# Altium project CAN_MODULE_DRIVER_V_0.0.PrjPcb
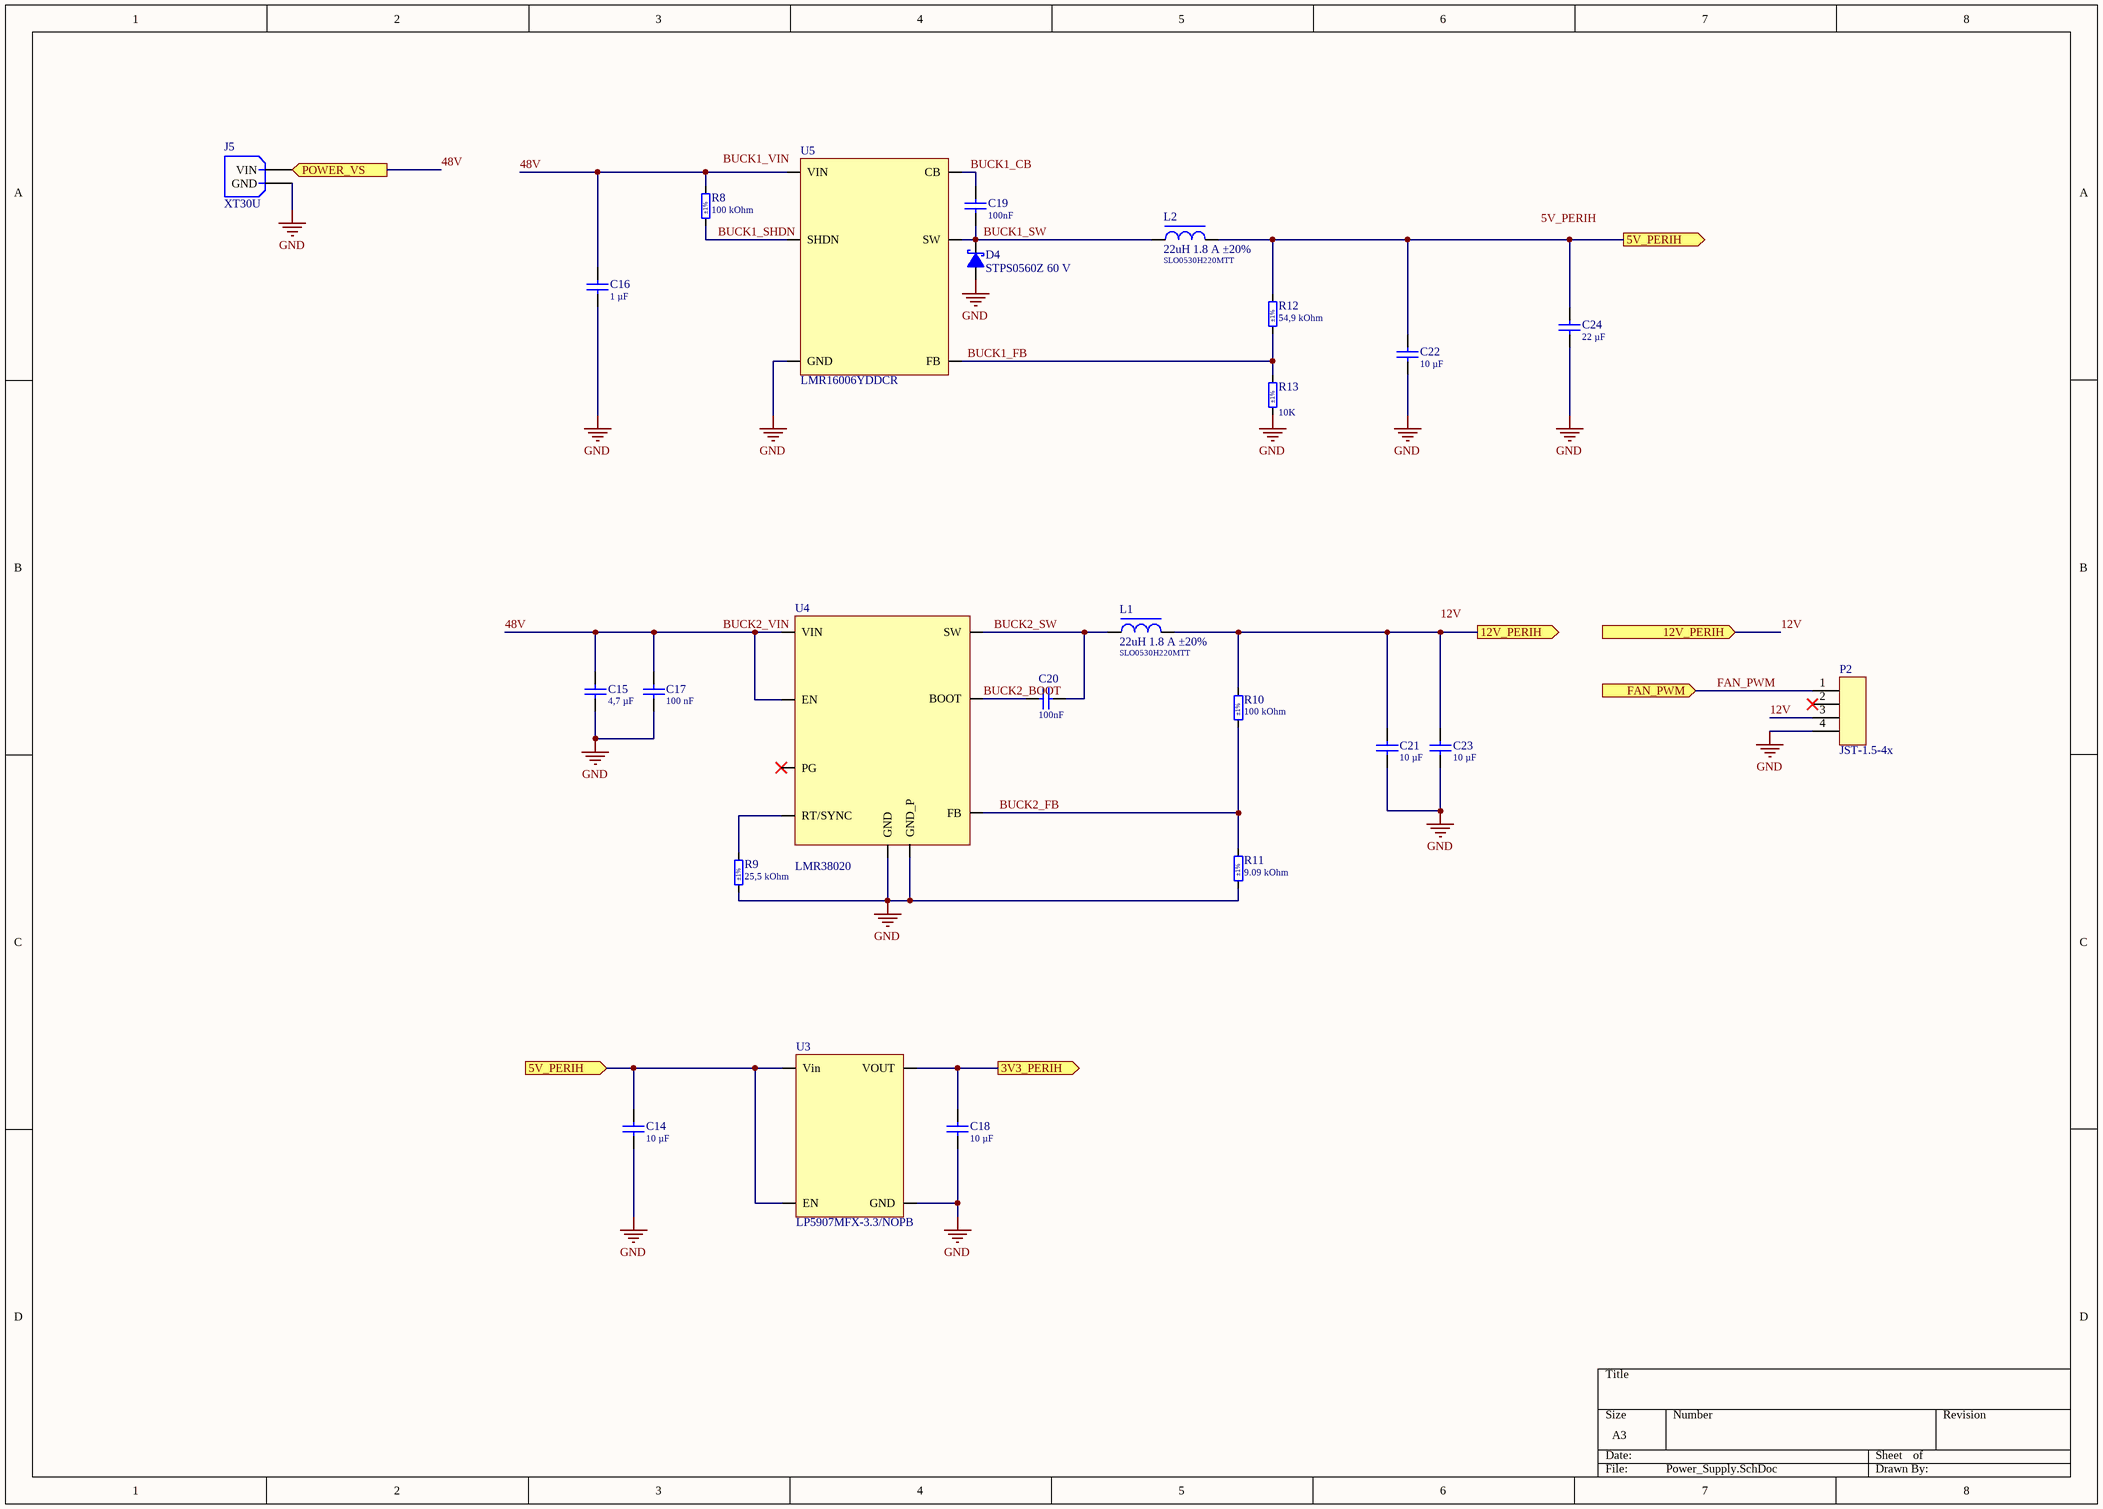
[diagram p0: Power_Supply.SchDoc]
3 sheets, 111 parts. Net scope: flat (ports and power ports of the same name join across sheets).
Board files: PCB3.PcbDoc, PCB4.PcbDoc
Sheets:
  Power_Supply.SchDoc
  Logic.~(138).SchDoc
  Driver.SchDoc

## Sheet Power_Supply.SchDoc
size A3

### Parts
C14  Capacitance: 10 µF  [0805]  (hidden comment: 10 µF 16V X5R ±10% 0805)
C15  Capacitance: 4,7 µF  [1206]  (hidden comment: 4,7 µF 100V X5R ±10% 1206)
C16  Capacitance: 1 µF  [0805]  (hidden comment: 1 µF 100V X5R ±10% 0805)
C17  Capacitance: 100 nF  [1206]  (hidden comment: 100 nF 100V X5R ±10% 1206)
C18  Capacitance: 10 µF  [0805]  (hidden comment: 10 µF 16V X5R ±10% 0805)
C19  Capacitance: 100nF  [0402]  (hidden comment: 100nF 16V X7R ±10% 0402)
C20  Capacitance: 100nF  [0402]  (hidden comment: 100nF 16V X7R ±10% 0402)
C21  Capacitance: 10 µF  [0805]  (hidden comment: 10 µF 16V X5R ±10% 0805)
C22  Capacitance: 10 µF  [0805]  (hidden comment: 10 µF 16V X5R ±10% 0805)
C23  Capacitance: 10 µF  [0805]  (hidden comment: 10 µF 16V X5R ±10% 0805)
C24  Capacitance: 22 µF  [0603]  (hidden comment: 22 µF 10V X5R ±10% 0603)
D4  STPS0560Z 60 V  [SOD-123FL]
J5  XT30U  [XT30U-M]
L1  22uH 1.8 A ±20%  Name: SLO0530H220MTT  [SMD 5.4x5.2mm]
L2  22uH 1.8 A ±20%  Name: SLO0530H220MTT  [SMD 5.4x5.2mm]
P2  JST-1.5-4x  [JST- 4X - 1.5]
R8  Resistance: 100 kOhm  [0402]  (hidden comment: 100 kOhm 1/8 W 0402)
R9  Resistance: 25,5 kOhm  [0402]  (hidden comment: 25,5 kOhm 1/16 W 0402)
R10  Resistance: 100 kOhm  [0402]  (hidden comment: 100 kOhm 1/8 W 0402)
R11  Resistance: 9.09 kOhm  [0402]  (hidden comment: 9.09 kOhm 1/16 W 0402)
R12  Resistance: 54,9 kOhm  [0402]  (hidden comment: 54,9 kOhm 1/16 W 0402)
R13  Resistance: 10K  [0402]  (hidden comment: 10K 1/5W 0402)
U3  LP5907MFX-3.3/NOPB  [SOT23-5]
U4  LMR38020  [SOIC-8_TP]
U5  LMR16006YDDCR  [SOT-23-6]

### Ports
3V3_PERIH (out), 5V_PERIH (in), 5V_PERIH (out), 12V_PERIH (in), 12V_PERIH (out), FAN_PWM (in), POWER_VS (out)

### Nets
3.3V: C18.1 U3.5(VOUT) ; port 3V3_PERIH
GND: C14.2 C15.2 C16.2 C17.2 C18.2 C21.2 C22.2 C23.2 C24.2 D4.2 J5.2(GND) P2.4 R9.1 R11.1 R13.1 U3.2(GND) U4.0(GND_P) U4.1(GND) U5.2(GND)
5V: C14.1 C22.1 C24.1 L2.2 R12.2 U3.1(Vin) U3.3(EN) ; port 5V_PERIH
12V: C21.1 C23.1 L1.2 P2.3 R10.2 ; port 12V_PERIH
48V: C15.1 C16.1 C17.1 J5.1(VIN) R8.2 U4.2(EN) U4.3(VIN) U5.5(VIN) ; port POWER_VS  [also labelled BUCK2_VIN]
BUCK1_CB: C19.2 U5.1(CB)
BUCK1_FB: R12.1 R13.2 U5.3(FB)
BUCK1_SHDN: R8.1 U5.4(SHDN)
BUCK1_SW: C19.1 D4.1 L2.1 U5.6(SW)
BUCK2_BOOT: C20.2 U4.7(BOOT)
BUCK2_FB: R10.1 R11.2 U4.5(FB)
BUCK2_SW: C20.1 L1.1 U4.8(SW)
FAN_PWM: P2.1 ; port FAN_PWM
NetR9_2: R9.2 U4.4(RT/SYNC)

Not connected (* = marked no-connect by the designer): P2 2*; U4 6(PG)*

### Notes on the sheet
- Labels drawn without touching a wire or pin: 5V_PERIH, 12V, BUCK1_VIN

### Library data of the parts
C14 C18 C21-C23 = Capacitor ceramic: Ceramic capacitor; Manufacturer: MURATA; HQ Part: CA0134789; Name: GRM21BR61C106KE15L; Voltage: 16V; Tolerance: ±10%; Dielectric: X5R; BOMString: =Capacitance+' '+Voltage+' '+Tolerance+' '+Footprint; HelpURL: *; Supplier: *
C15 = Capacitor ceramic: Ceramic capacitor; Manufacturer: Taiyo Yuden; Name: HMK325BJ475KN-TE; Voltage: 100V; Tolerance: ±10%; Dielectric: X5R; BOMString: =Capacitance+' '+Voltage+' '+Tolerance+' '+Footprint; HelpURL: *; Supplier: *
C16 = Capacitor ceramic: Ceramic capacitor; Manufacturer: Yageo; Name: CC0805KKX7R0BB105; Voltage: 100V; Tolerance: ±10%; Dielectric: X5R; BOMString: =Capacitance+' '+Voltage+' '+Tolerance+' '+Footprint; HelpURL: *; Supplier: *
C17 = Capacitor ceramic: Ceramic capacitor; Manufacturer: MURATA; Name: GRM155R62A104KE14D; Voltage: 100V; Tolerance: ±10%; Dielectric: X5R; BOMString: =Capacitance+' '+Voltage+' '+Tolerance+' '+Footprint; HelpURL: *; Supplier: *
C19 C20 = Capacitor ceramic: Ceramic capacitor; Manufacturer: Yageo; Name: CC0402KRX7R7BB104; Voltage: 16V; Tolerance: ±10%; Dielectric: X7R; BOMString: =Capacitance+' '+Voltage+' '+Tolerance+' '+Footprint; HelpURL: *; Supplier: *
C24 = Capacitor ceramic: Ceramic capacitor; Manufacturer: Yageo; Name: CC0603MRX5R6BB226; Voltage: 10V; Tolerance: ±10%; Dielectric: X5R; BOMString: =Capacitance+' '+Voltage+' '+Tolerance+' '+Footprint; HelpURL: *; Supplier: *
D4 = SchottkyDiode: Schottky Diode; Manufacturer: ST; HQ Part: DS0002882; Voltage: 60 V; Device: diode; Supplier: supplier; Price(1): 0; Price(100): 0; Name: STPS0560Z; BOMString: =Name+' '+Current+' '+Voltage+' 'Footprint
L1 L2 = Inductance cored: Inductor with iron core; Manufacturer: Sunltech; Current: 1.8 A; Resistance: 265mΩ; Inductance: 22uH; Tolerance: ±20%; BOMString: =Inductance+' '+Tolerance+' '+Footprint; HelpURL: *; Supplier: *
R8 = Resistor: Thik Film Chip Resistor; Manufacturer: Yageo; Power: 1/8 W; Tolerance: ±1%; Name: RC0402FR-7W100KL; Supplier: *; HelpURL: *; BOMString: =Resistance+' '+Tolerance+' '+Power+' '+Footprint
R9 = Resistor: Thik Film Chip Resistor; Manufacturer: Yageo; Power: 1/16 W; Tolerance: ±1%; Name: RC0402FR-0725K5L; Supplier: *; HelpURL: *; BOMString: =Resistance+' '+Tolerance+' '+Power+' '+Footprint
R10 = Resistor: Thik Film Chip Resistor; Manufacturer: Yageo; HQ Part: RE0186870; Power: 1/8 W; Tolerance: ±1%; Name: RC0402FR-7W100KL; Supplier: *; HelpURL: *; BOMString: =Resistance+' '+Tolerance+' '+Power+' '+Footprint
R11 = Resistor: Thik Film Chip Resistor; Manufacturer: Ralec; Power: 1/16 W; Tolerance: ±1%; Name: RTT029091FTH; Supplier: *; HelpURL: *; BOMString: =Resistance+' '+Tolerance+' '+Power+' '+Footprint
R12 = Resistor: Thik Film Chip Resistor; Manufacturer: Yageo; HQ Part: RE0186870; Power: 1/16 W; Tolerance: ±1%; Name: RC0402FR-0754K9L; Supplier: *; HelpURL: *; BOMString: =Resistance+' '+Tolerance+' '+Power+' '+Footprint
R13 = Resistor: Thin Film Chip Resistor; Manufacturer: YAGEO; Tolerance: ±1%; Name: SR0402FR-7T10KL; Power: 1/5W; Supplier: *; HelpURL: *; BOMString: =Resistance+' '+Tolerance+' '+Power+' '+Footprint
U3 = LP5907MFX-3.3/NOPB: "Low-dropout regulator"
U4 = LMR38020: Name: LMR38020; Manufacturer: *; BOMString: *; Value: *; Parameter 5: *; Parameter 6: *

## Sheet Logic.~(138).SchDoc
size A3
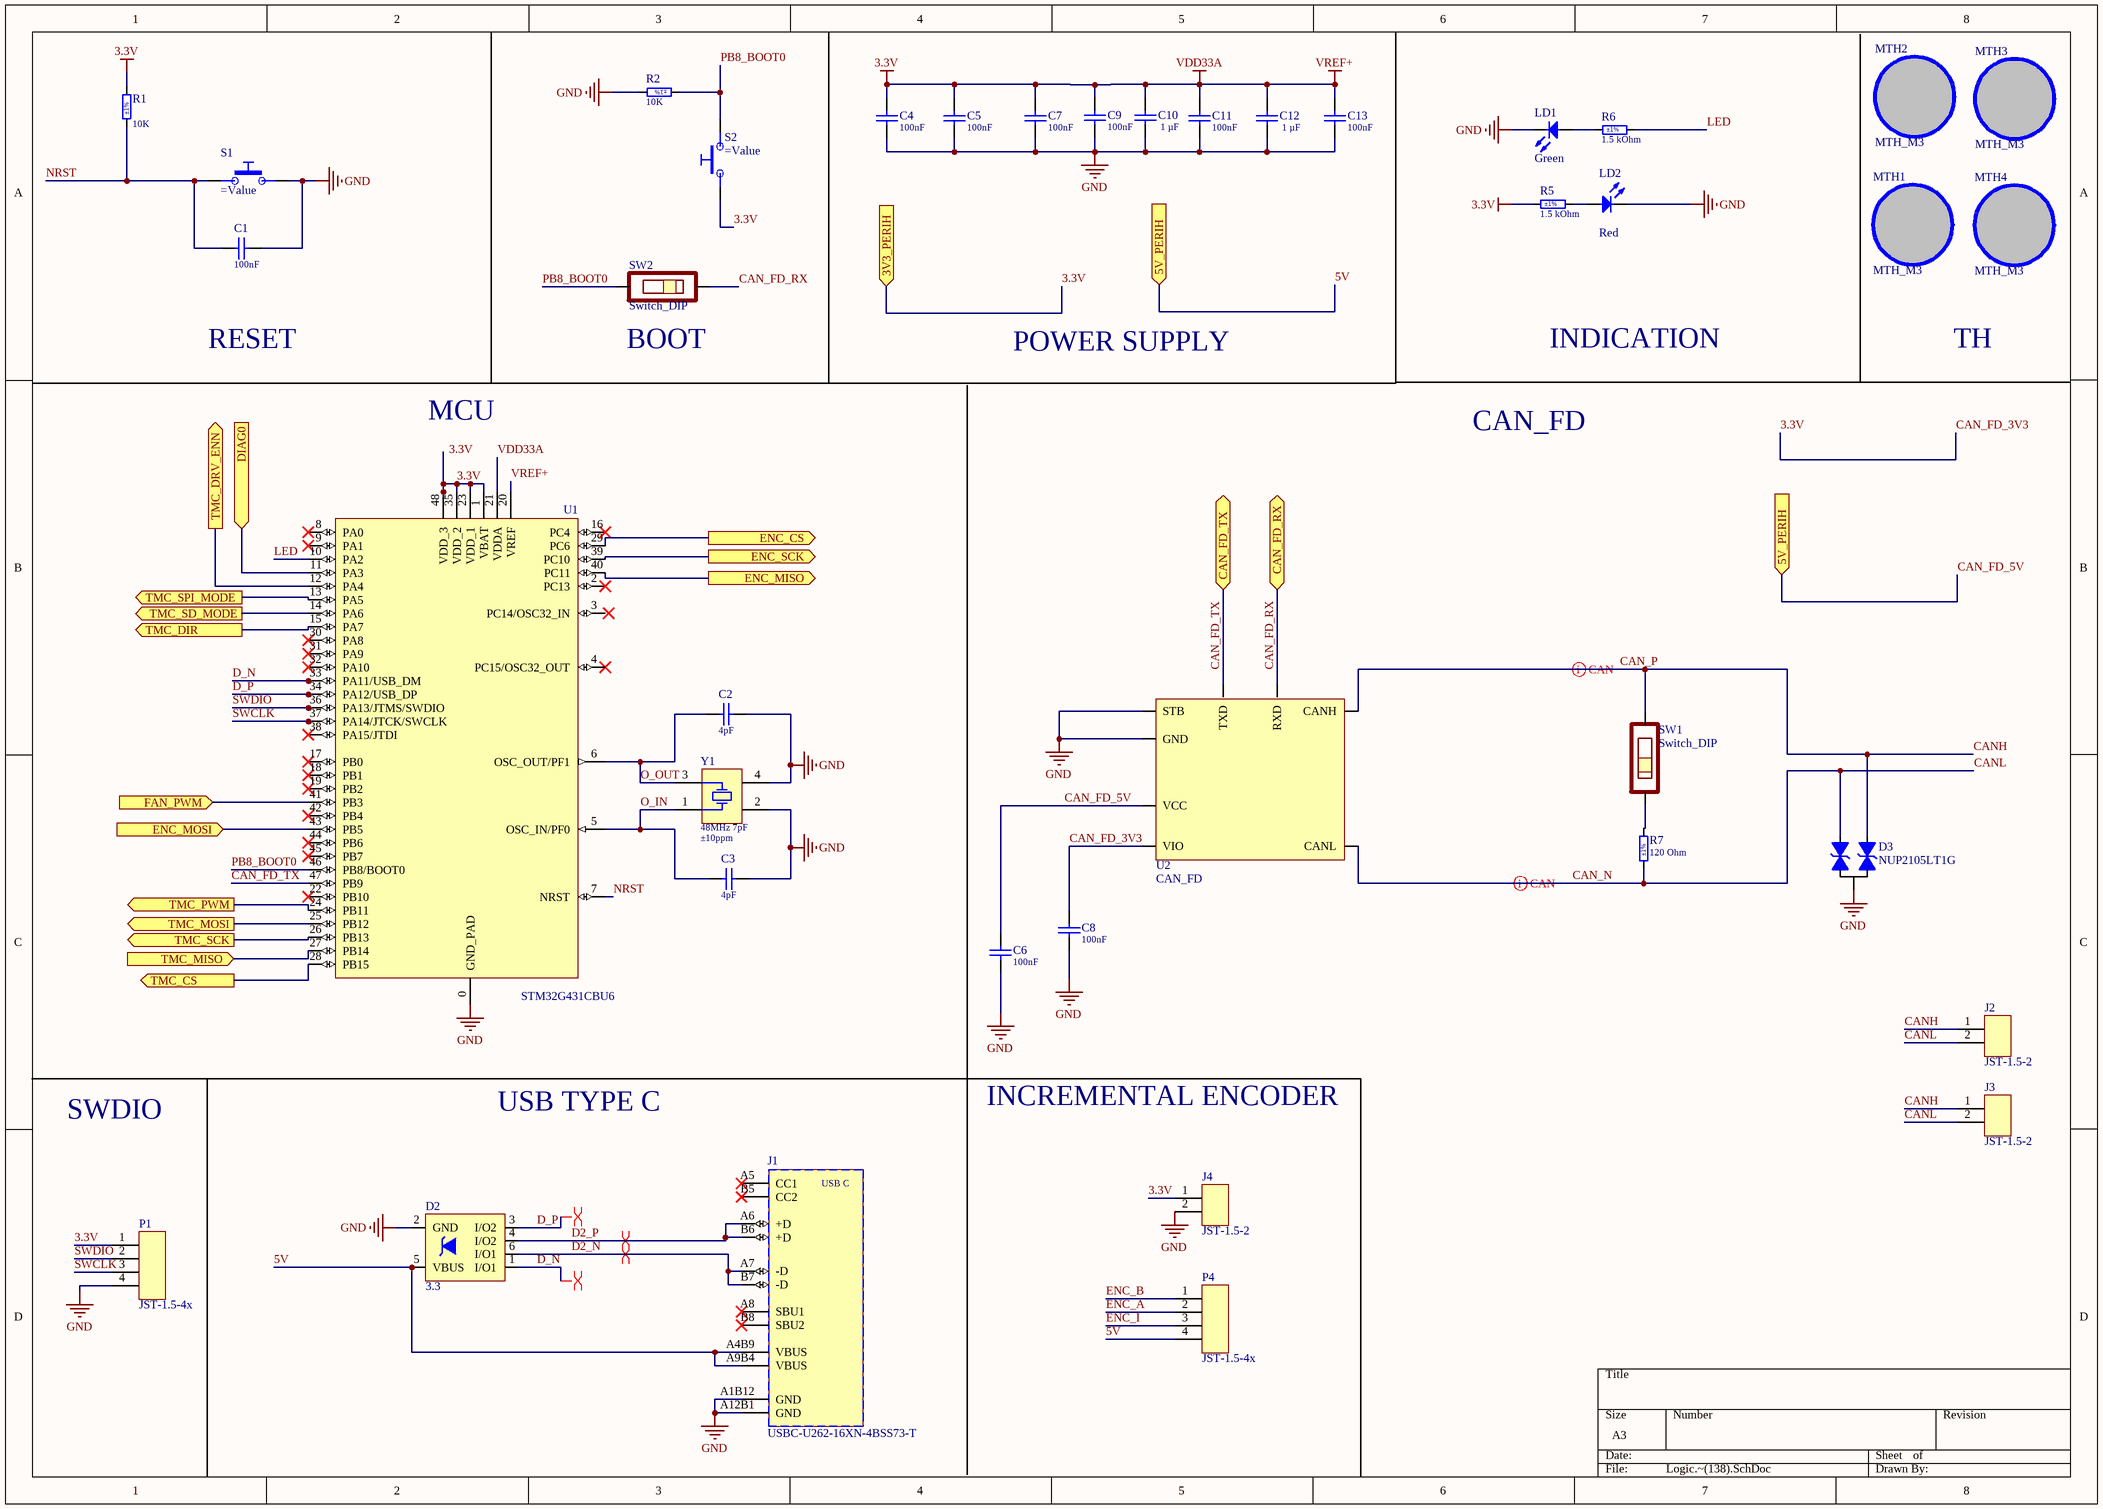
[diagram p1: Logic.~(138).SchDoc]

### Parts
C1  Capacitance: 100nF  [0402]  (hidden comment: 100nF 16V X7R ±10% 0402)
C2  Capacitance: 4pF  [0402]  (hidden comment: 4pF 50V C0G (NP0) ±0.25 pF 0402)
C3  Capacitance: 4pF  [0402]  (hidden comment: 4pF 50V C0G (NP0) ±0.25 pF 0402)
C4  Capacitance: 100nF  [0402]  (hidden comment: 100nF 16V X7R ±10% 0402)
C5  Capacitance: 100nF  [0402]  (hidden comment: 100nF 16V X7R ±10% 0402)
C6  Capacitance: 100nF  [0402]  (hidden comment: 100nF 16V X7R ±10% 0402)
C7  Capacitance: 100nF  [0402]  (hidden comment: 100nF 16V X7R ±10% 0402)
C8  Capacitance: 100nF  [0402]  (hidden comment: 100nF 16V X7R ±10% 0402)
C9  Capacitance: 100nF  [0402]  (hidden comment: 100nF 16V X7R ±10% 0402)
C10  Capacitance: 1 µF  [0402]  (hidden comment: 1 µF 16V X5R ±10% 0402)
C11  Capacitance: 100nF  [0402]  (hidden comment: 100nF 16V X7R ±10% 0402)
C12  Capacitance: 1 µF  [0402]  (hidden comment: 1 µF 16V X5R ±10% 0402)
C13  Capacitance: 100nF  [0402]  (hidden comment: 100nF 16V X7R ±10% 0402)
D2  3.3  [SOT23-6L]
D3  Name: NUP2105LT1G  [SOT-23]  (hidden comment: VRWM=24V, VBR(Min)=26.2 V, VC=44 V)
J1  USBC-U262-16XN-4BSS73-T  [KH-TYPE-C-16P-T]
J2  JST-1.5-2  [JST- 2 X - 1.5]
J3  JST-1.5-2  [JST- 2 X - 1.5]
J4  JST-1.5-2  [JST- 2 X - 1.5]
LD1  Color: Green  [0402 GREEN FLAT]  (hidden comment: SZYY0402G (Green) / 0402 GREEN FLAT)
LD2  Color: Red  [0402 RED FLAT]  (hidden comment: SML-P11UTT86R (Red) / 0402 RED FLAT)
MTH1  MTH_M3  [MTH]
MTH2  MTH_M3  [MTH]
MTH3  MTH_M3  [MTH]
MTH4  MTH_M3  [MTH]
P1  JST-1.5-4x  [JST- 4X - 1.5]
P4  JST-1.5-4x  [JST- 4X - 1.5]
R1  Resistance: 10K  [0402]  (hidden comment: 10K 1/5W 0402)
R2  Resistance: 10K  [0402]  (hidden comment: 10K 1/5W 0402)
R5  Resistance: 1.5 kOhm  [0402]  (hidden comment: 1.5 kOhm 1/16W 0402)
R6  Resistance: 1.5 kOhm  [0402]  (hidden comment: 1.5 kOhm 1/16W 0402)
R7  Resistance: 120 Ohm  [0402]  (hidden comment: 120 Ohm 1/8 W 0402)
S1  (no value)  [B3U3000P]
S2  (no value)  [B3U3000P]
SW1  Switch_DIP  [SMD 2.9x5.4mm]
SW2  Switch_DIP  [SMD 2.9x5.4mm]
U1  STM32G431CBU6  [QFN-48-0.5-7x7_TP]
U2  CAN_FD  [SOIC-8]
Y1  Frequency: 48MHz 7pF  Tolerance: ±10ppm  [2016]  (hidden comment: 48MHz 7pF ±10ppm 2016)

### Ports
3V3_PERIH (in), 5V_PERIH (in), CAN_FD_RX (bidir), CAN_FD_TX (bidir), DIAG0 (in), ENC_CS (out), ENC_MISO (out), ENC_MOSI (in), ENC_SCK (out), FAN_PWM (in), TMC_CS (out), TMC_DIR (out), TMC_DRV_ENN (out), TMC_MISO (in), TMC_MOSI (out), TMC_PWM (out), TMC_SCK (out), TMC_SD_MODE (out), TMC_SPI_MODE (out)

### Nets
3.3V: C4.2 C5.2 C7.2 C8.2 C9.2 C10.1 C11.2 C12.1 C13.2 J4.1 P1.1 R1.2 R5.1 S2.1 U1.1(VBAT) U1.20(VREF) U1.21(VDDA) U1.23(VDD_1) U1.35(VDD_2) U1.48(VDD_3) U2.5(VIO) ; port 3V3_PERIH  [also labelled CAN_FD_3V3, VDD33A, VREF+]
GND: C1.1 C2.2 C3.2 C4.1 C5.1 C6.1 C7.1 C8.1 C9.1 C10.2 C11.1 C12.2 C13.1 D2.2(GND) D3.3 J1.A1B12(GND) J1.A12B1(GND) J4.2 LD1.2(C) LD2.2(C) P1.4 R2.2 S1.2 U1.0(GND_PAD) U2.2(GND) U2.8(STB) Y1.2(GND) Y1.4(GND)
5V: C6.2 D2.5(VBUS) J1.A4B9(VBUS) J1.A9B4(VBUS) P4.4 U2.3(VCC) ; port 5V_PERIH  [also labelled CAN_FD_5V]
CAN_FD_RX: SW2.2 U2.4(RXD) ; port CAN_FD_RX
CAN_FD_TX: U1.47(PB9) U2.1(TXD) ; port CAN_FD_TX
CAN_N: D3.2 J2.2 J3.2 R7.1 U2.6(CANL)  [also labelled CANL]
CAN_P: D3.1 J2.1 J3.1 SW1.1 U2.7(CANH)  [also labelled CANH]
D2_N: D2.6(I/O1) J1.A7(-D) J1.B7(-D)
D2_P: D2.4(I/O2) J1.A6(+D) J1.B6(+D)
D_N: D2.1(I/O1) U1.33(PA11/USB_DM)
D_P: D2.3(I/O2) U1.34(PA12/USB_DP)
DIAG0: U1.11(PA3) ; port DIAG0
ENC_A: P4.2
ENC_B: P4.1
ENC_CS: U1.29(PC6) ; port ENC_CS
ENC_I: P4.3
ENC_MISO: U1.40(PC11) ; port ENC_MISO
ENC_MOSI: U1.43(PB5) ; port ENC_MOSI
ENC_SCK: U1.39(PC10) ; port ENC_SCK
FAN_PWM: U1.41(PB3) ; port FAN_PWM
LED: R6.2 U1.10(PA2)
NRST: C1.2 R1.1 S1.1 U1.7(NRST)
O_IN: C3.1 U1.5(OSC_IN/PF0) Y1.1(X)
O_OUT: C2.1 U1.6(OSC_OUT/PF1) Y1.3(X)
PB8_BOOT0: R2.1 S2.2 SW2.1 U1.46(PB8/BOOT0)
SD_MODE: U1.14(PA6) ; port TMC_SD_MODE
SPI_MODE: U1.13(PA5) ; port TMC_SPI_MODE
SWCLK: P1.3 U1.37(PA14/JTCK/SWCLK)
SWDIO: P1.2 U1.36(PA13/JTMS/SWDIO)
TMC_CS: U1.28(PB15) ; port TMC_CS
TMC_DIR: U1.15(PA7) ; port TMC_DIR
TMC_DRV_ENN: U1.12(PA4) ; port TMC_DRV_ENN
TMC_MISO: U1.27(PB14) ; port TMC_MISO
TMC_MOS: U1.25(PB12) ; port TMC_MOSI
TMC_PWM: U1.24(PB11) ; port TMC_PWM
TMC_SCK: U1.26(PB13) ; port TMC_SCK
NetLD1_1: LD1.1(A) R6.1
NetLD2_1: LD2.1(A) R5.2
NetR7_2: R7.2 SW1.2

Not connected (* = marked no-connect by the designer): J1 A5(CC1)* A8(SBU1)* B5(CC2)* B8(SBU2)*; U1 2(PC13)* 3(PC14/OSC32_IN) 4(PC15/OSC32_OUT)* 8(PA0)* 9(PA1)* 16(PC4)* 17(PB0)* 18(PB1)* 19(PB2)* 22(PB10)* 30(PA8)* 31(PA9)* 32(PA10)* 38(PA15/JTDI)* 42(PB4)* 44(PB6)* 45(PB7)*

### Layout directives
differential pair: CAN_N, CAN_P, D2_N, D2_P, D_N, D_P

### Notes on the sheet
- RESET
- (near SW2) BOOT
- POWER SUPPLY
- INDICATION
- TH
- MCU
- CAN_FD
- SWDIO
- USB TYPE C
- INCREMENTAL ENCODER
- Labels drawn without touching a wire or pin: 3.3V
- (in symbol USBC-U262-16XN-4BSS73-T) USB C

### Library data of the parts
C1 C4-C9 C11 C13 = Capacitor ceramic: as C19 on sheet Power_Supply; Voltage: 16V; Tolerance: ±10%; Dielectric: X7R; BOMString: =Capacitance+' '+Voltage+' '+Tolerance+' '+Footprint; HelpURL: *; Supplier: *
C2 C3 = Capacitor ceramic: Ceramic capacitor; Manufacturer: Murata; Tolerance: ±0.25 pF; Name: CC0402CRNPO9BN4R0; Voltage: 50V; Dielectric: C0G (NP0); BOMString: =Capacitance+' '+Voltage+' '+Tolerance+' '+Footprint; HelpURL: *; Supplier: *
C10 C12 = Capacitor ceramic: Ceramic capacitor; Manufacturer: Yageo; Name: CC0402KRX5R7BB105; Voltage: 16V; Tolerance: ±10%; Dielectric: X5R; BOMString: =Capacitance+' '+Voltage+' '+Tolerance+' '+Footprint; HelpURL: *; Supplier: *
D2 = TWS_USB_sot23: TWS; Manufacturer: ST; BOMString: USBLC6-2SC6 3.3; Name: USBLC6-2SC6; Price: 0; Price10k: 0; Value: 3.3
D3 = ZenerDiodeDoubleCCBidir: Zener Diode double CC; Manufacturer: ON; HQ Part: CP0103362; BOMString: ESD VRWM=24V, VBR(Min)=26.2 V, VC=44 V, IPP = 8A, Ppp = 350W, SOT23; Device: diode; Supplier: supplier; Price(1): 0; Price(100): 0; Value: VRWM=24V, VBR(Min)=26.2 V, VC=44 V
LD1 = LED Green: Green LED; Manufacturer: YONGYU; Current: 15 mA; Name: SZYY0402G; BOMString: =Name+' ('+Color+ ') / '+' '+Current+' '+Footprint; Supplier: *; HelpURL: *
LD2 = LED Red: Red LED; Manufacturer: ROHM; Current: 20 mA; Name: SML-P11UTT86R; BOMString: =Name+' ('+Color+ ') / '+' '+Current+' '+Footprint; HelpURL: *; Supplier: *; Parameter 1: *
R1 R2 = Resistor: as R13 on sheet Power_Supply; Power: 1/5W; Supplier: *; HelpURL: *; BOMString: =Resistance+' '+Tolerance+' '+Power+' '+Footprint
R5 R6 = Resistor: Thin Film Chip Resistor; Manufacturer: YAGEO; Tolerance: ±1%; Name: AC0402FR-071K5L; Power: 1/16W; Supplier: *; HelpURL: *; BOMString: =Resistance+' '+Tolerance+' '+Power+' '+Footprint
R7 = Resistor: Thick Film Chip Resistor; Manufacturer: Yageo; HQ Part: RE0210070; Power: 1/8 W; Tolerance: ±1%; Name: RC0402FR-7W120RL; Supplier: *; HelpURL: *; BOMString: =Resistance+' '+Tolerance+' '+Power+' '+Footprint; Supplier 1: Future Electronics
S1 S2 = TactileButton2pin: SMD Tactile switch; Value: B3U3000P; Supplier: http://www.compel.ru/infosheet/TE/1437566-3; Price(1): 0.218; Price(100): 0.1817; Datasheet: http://www.te.com/usa-en/product-1437566-3.html; BOMString: =Footprint; Name: =Footprint
Y1 = Crystal 4 pin: Quartz crystal; Manufacturer: HD FREQUENCY; Name: 7D048000C01; HelpURL: http://geyer-electronic.de/uploads/tx_userartikelfrequenz/GEYER-KX-9A_01.pdf; Supplier: *; BOMString: =Frequency+' '+Tolerance+' '+Footprint

## Sheet Driver.SchDoc
size A3
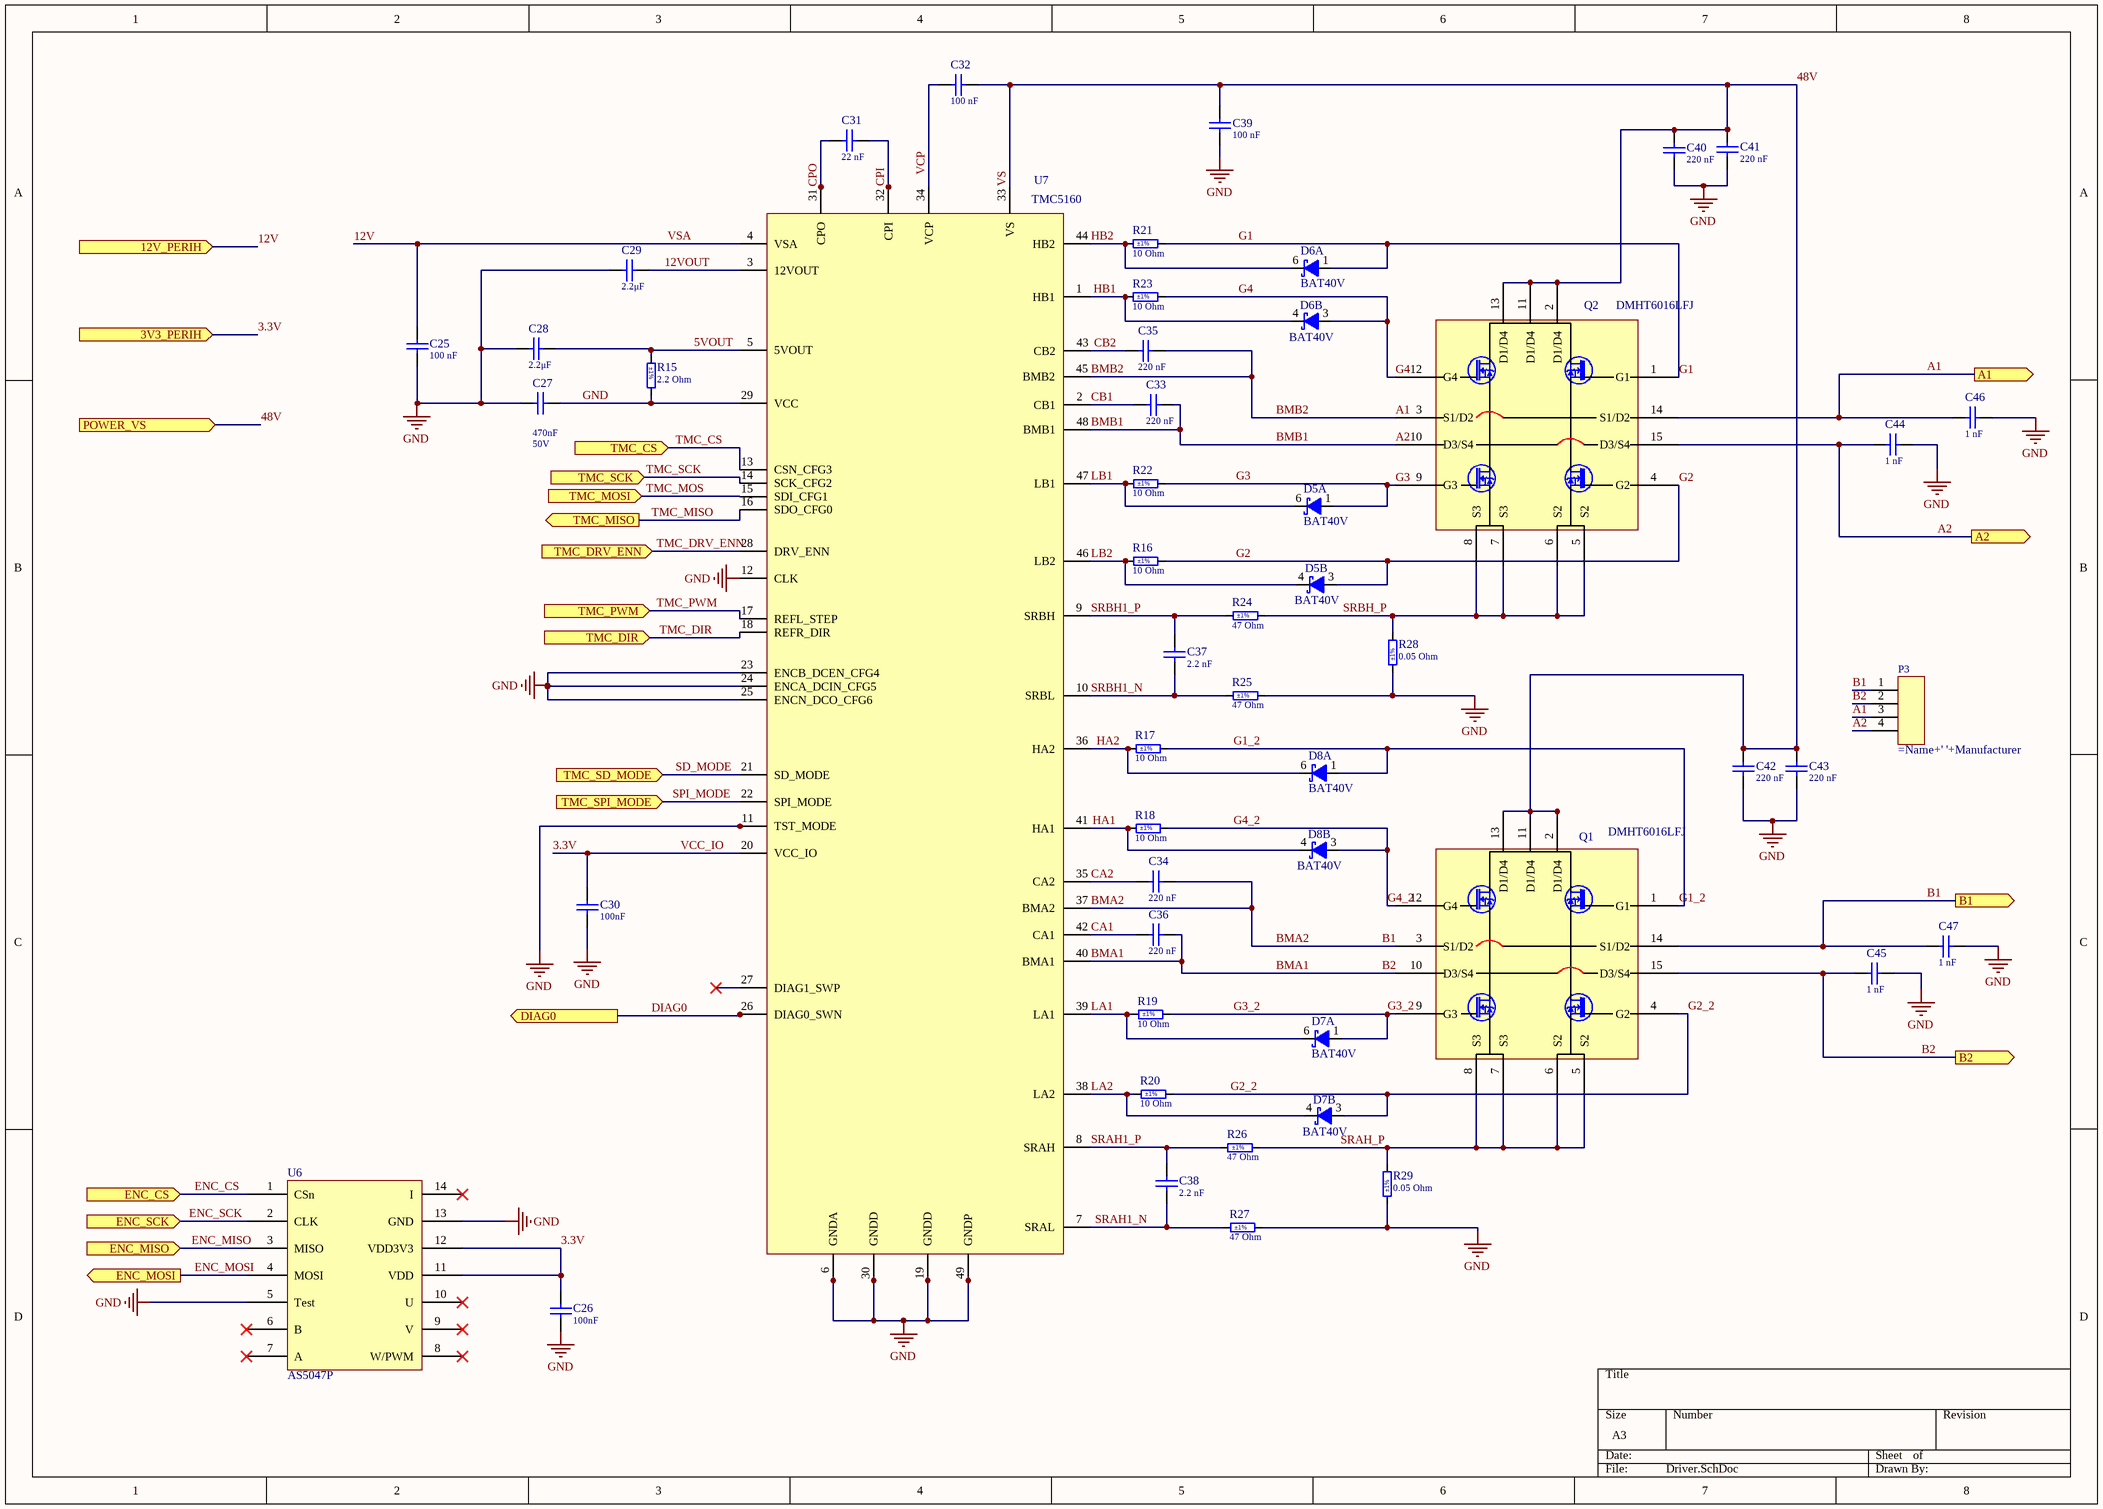
[diagram p2: Driver.SchDoc]

### Parts
C25  Capacitance: 100 nF  [0402]  (hidden comment: 100 nF 100V X5R ±10% 0402)
C26  Capacitance: 100nF  [0402]  (hidden comment: 100nF 16V X7R ±10% 0402)
C27  Capacitance: 470nF  Voltage: 50V  [0402]  (hidden comment: 470nF 50V ±10% 0402)
C28  Capacitance: 2.2μF  [0402]  (hidden comment: 2.2μF 16V X5R 20% 0402)
C29  Capacitance: 2.2μF  [0402]  (hidden comment: 2.2μF 16V X5R 20% 0402)
C30  Capacitance: 100nF  [0402]  (hidden comment: 100nF 16V X7R ±10% 0402)
C31  Capacitance: 22 nF  [0603]  (hidden comment: 22 nF 100V X7R ±10% 0603)
C32  Capacitance: 100 nF  [0402]  (hidden comment: 100 nF 100V X5R ±10% 0402)
C33  Capacitance: 220 nF  [0402]  (hidden comment: 220 nF 25 X7R ±10% 0402)
C34  Capacitance: 220 nF  [0402]  (hidden comment: 220 nF 25 X7R ±10% 0402)
C35  Capacitance: 220 nF  [0603]  (hidden comment: 220 nF 25 X7R ±10% 0603)
C36  Capacitance: 220 nF  [0603]  (hidden comment: 220 nF 25 X7R ±10% 0603)
C37  Capacitance: 2.2 nF  [0402]  (hidden comment: 2.2 nF 100V X7R ±10% 0402)
C38  Capacitance: 2.2 nF  [0402]  (hidden comment: 2.2 nF 100V X7R ±10% 0402)
C39  Capacitance: 100 nF  [0402]  (hidden comment: 100 nF 100V X5R ±10% 0402)
C40  Capacitance: 220 nF  [0603]  (hidden comment: 220 nF 100V X7S ±10% 0603)
C41  Capacitance: 220 nF  [0603]  (hidden comment: 220 nF 100V X7S ±10% 0603)
C42  Capacitance: 220 nF  [0603]  (hidden comment: 220 nF 100V X7S ±10% 0603)
C43  Capacitance: 220 nF  [0603]  (hidden comment: 220 nF 100V X7S ±10% 0603)
C44  Capacitance: 1 nF  [0402]  (hidden comment: 1 nF 100V X7R ±10% 0402)
C45  Capacitance: 1 nF  [0402]  (hidden comment: 1 nF 100V X7R ±10% 0402)
C46  Capacitance: 1 nF  [0402]  (hidden comment: 1 nF 100V X7R ±10% 0402)
C47  Capacitance: 1 nF  [0402]  (hidden comment: 1 nF 100V X7R ±10% 0402)
D5  BAT40V  [SOT563-6]  (parts A,B of 2)
D6  BAT40V  [SOT563-6]  (parts A,B of 2)
D7  BAT40V  [SOT563-6]  (parts A,B of 2)
D8  BAT40V  [SOT563-6]  (parts A,B of 2)
P3  (no value)  [15EDGRC-3.5-04P]
Q1  DMHT6016LFJ  [V-DFN5045-12 (Type B)]
Q2  DMHT6016LFJ  [V-DFN5045-12 (Type B)]
R15  Resistance: 2.2 Ohm  [0603]  (hidden comment: 2.2 Ohm 1/10 W 0603)
R16  Resistance: 10 Ohm  [0402]  (hidden comment: 10 Ohm 1/16 W 0402)
R17  Resistance: 10 Ohm  [0402]  (hidden comment: 10 Ohm 1/16 W 0402)
R18  Resistance: 10 Ohm  [0402]  (hidden comment: 10 Ohm 1/16 W 0402)
R19  Resistance: 10 Ohm  [0402]  (hidden comment: 10 Ohm 1/16 W 0402)
R20  Resistance: 10 Ohm  [0402]  (hidden comment: 10 Ohm 1/16 W 0402)
R21  Resistance: 10 Ohm  [0402]  (hidden comment: 10 Ohm 1/16 W 0402)
R22  Resistance: 10 Ohm  [0402]  (hidden comment: 10 Ohm 1/16 W 0402)
R23  Resistance: 10 Ohm  [0402]  (hidden comment: 10 Ohm 1/16 W 0402)
R24  Resistance: 47 Ohm  [0402]  (hidden comment: 47 Ohm 1/16 W 0402)
R25  Resistance: 47 Ohm  [0402]  (hidden comment: 47 Ohm 1/16 W 0402)
R26  Resistance: 47 Ohm  [0402]  (hidden comment: 47 Ohm 1/16 W 0402)
R27  Resistance: 47 Ohm  [0402]  (hidden comment: 47 Ohm 1/16 W 0402)
R28  Resistance: 0.05 Ohm  [1206]  (hidden comment: 0.05 Ohm 1 W 1206)
R29  Resistance: 0.05 Ohm  [1206]  (hidden comment: 0.05 Ohm 1 W 1206)
U6  AS5047P  [TSSOP-14-0.65]
U7  TMC5160  [TQFP48-0.5-EP]

### Ports
3V3_PERIH (in), 12V_PERIH (in), A1 (out), A2 (out), B1 (out), B2 (out), DIAG0 (out), ENC_CS (in), ENC_MISO (in), ENC_MOSI (out), ENC_SCK (in), POWER_VS (in), TMC_CS (in), TMC_DIR (in), TMC_DRV_ENN (in), TMC_MISO (out), TMC_MOSI (in), TMC_PWM (in), TMC_SCK (in), TMC_SD_MODE (in), TMC_SPI_MODE (in)

### Nets
3.3V: C26.2 C30.2 U6.11(VDD) U6.12(VDD3V3) U7.20(VCC_IO) ; port 3V3_PERIH  [also labelled VCC_IO]
GND: C25.2 C26.1 C27.1 C27.2 C28.1 C29.1 C30.1 C39.2 C40.2 C41.1 C42.1 C43.1 C44.1 C45.1 C46.1 C47.1 R15.2 R25.2 R27.2 R28.1 R29.1 U6.5(Test) U6.13(GND) U7.6(GNDA) U7.11(TST_MODE) U7.12(CLK) U7.19(GNDD) U7.23(ENCB_DCEN_CFG4) U7.24(ENCA_DCIN_CFG5) U7.25(ENCN_DCO_CFG6) U7.29(VCC) U7.30(GNDD) U7.49(GNDP)
5VOUT: C28.2 R15.1 U7.5(5VOUT)
12V: C25.1 U7.4(VSA) ; port 12V_PERIH  [also labelled VSA]
12VOUT: C29.2 U7.3(12VOUT)
48V: C32.2 C39.1 C40.1 C41.2 C42.2 C43.2 Q1.2(D1/D4) Q1.11(D1/D4) Q1.13(D1/D4) Q2.2(D1/D4) Q2.11(D1/D4) Q2.13(D1/D4) U7.33(VS) ; port POWER_VS  [also labelled VS]
A1: C35.2 C46.2 P3.3 Q2.3(S1/D2) Q2.14(S1/D2) U7.45(BMB2) ; port A1  [also labelled BMB2]
A2: C33.2 C44.2 P3.4 Q2.10(D3/S4) Q2.15(D3/S4) U7.48(BMB1) ; port A2  [also labelled BMB1]
B1: C34.2 C47.2 P3.1 Q1.3(S1/D2) Q1.14(S1/D2) U7.37(BMA2) ; port B1  [also labelled BMA2]
B2: C36.2 C45.2 P3.2 Q1.10(D3/S4) Q1.15(D3/S4) U7.40(BMA1) ; port B2  [also labelled BMA1]
CA1: C36.1 U7.42(CA1)
CA2: C34.1 U7.35(CA2)
CB1: C33.1 U7.2(CB1)
CB2: C35.1 U7.43(CB2)
CPI: C31.2 U7.32(CPI)
CPO: C31.1 U7.31(CPO)
DIAG0: U7.26(DIAG0_SWN) ; port DIAG0
ENC_CS: U6.1(CSn) ; port ENC_CS
ENC_MISO: U6.3(MISO) ; port ENC_MISO
ENC_MOSI: U6.4(MOSI) ; port ENC_MOSI
ENC_SCK: U6.2(CLK) ; port ENC_SCK
G1: D6.1 Q2.1(G1) R21.2
G1_2: D8.1 Q1.1(G1) R17.2
G2: D5.3 Q2.4(G2) R16.2
G2_2: D7.3 Q1.4(G2) R20.2
G3: D5.1 Q2.9(G3) R22.2
G3_2: D7.1 Q1.9(G3) R19.2
G4: D6.3 Q2.12(G4) R23.2
G4_2: D8.3 Q1.12(G4) R18.2
HA1: D8.4 R18.1 U7.41(HA1)
HA2: D8.6 R17.1 U7.36(HA2)
HB1: D6.4 R23.1 U7.1(HB1)
HB2: D6.6 R21.1 U7.44(HB2)
LA1: D7.6 R19.1 U7.39(LA1)
LA2: D7.4 R20.1 U7.38(LA2)
LB1: D5.6 R22.1 U7.47(LB1)
LB2: D5.4 R16.1 U7.46(LB2)
SD_MODE: U7.21(SD_MODE) ; port TMC_SD_MODE
SPI_MODE: U7.22(SPI_MODE) ; port TMC_SPI_MODE
SRAH1_N: C38.1 R27.1 U7.7(SRAL)
SRAH1_P: C38.2 R26.1 U7.8(SRAH)
SRAH_P: Q1.5(S2) Q1.6(S2) Q1.7(S3) Q1.8(S3) R26.2 R29.2
SRBH1_N: C37.1 R25.1 U7.10(SRBL)
SRBH1_P: C37.2 R24.1 U7.9(SRBH)
SRBH_P: Q2.5(S2) Q2.6(S2) Q2.7(S3) Q2.8(S3) R24.2 R28.2
TMC_CS: U7.13(CSN_CFG3) ; port TMC_CS
TMC_DIR: U7.18(REFR_DIR) ; port TMC_DIR
TMC_DRV_ENN: U7.28(DRV_ENN) ; port TMC_DRV_ENN
TMC_MISO: U7.16(SDO_CFG0) ; port TMC_MISO
TMC_MOS: U7.15(SDI_CFG1) ; port TMC_MOSI
TMC_PWM: U7.17(REFL_STEP) ; port TMC_PWM
TMC_SCK: U7.14(SCK_CFG2) ; port TMC_SCK
VCP: C32.1 U7.34(VCP)

Not connected (* = marked no-connect by the designer): U6 6(B)* 7(A)* 8(W/PWM)* 9(V)* 10(U)* 14(I)*; U7 27(DIAG1_SWP)*

### Library data of the parts
C25 C32 C39 = Capacitor ceramic: as C17 on sheet Power_Supply; Voltage: 100V; Tolerance: ±10%; Dielectric: X5R; BOMString: =Capacitance+' '+Voltage+' '+Tolerance+' '+Footprint; HelpURL: *; Supplier: *
C26 C30 = Capacitor ceramic: as C19 on sheet Power_Supply; Voltage: 16V; Tolerance: ±10%; Dielectric: X7R; BOMString: =Capacitance+' '+Voltage+' '+Tolerance+' '+Footprint; HelpURL: *; Supplier: *
C27 = Cap: Capacitor; Manufacturer: Walsin; Name: 0402X474K500CT; Tolerance: ±10%; BOMString: =Capacitance+' '+Voltage+' '+Tolerance+' '+Footprint; HelpURL: *; Supplier: *
C28 C29 = Capacitor ceramic: Ceramic capacitor; Manufacturer: FH; Name: 0402X225M160NT; Voltage: 16V; Tolerance: 20%; Dielectric: X5R; BOMString: =Capacitance+' '+Voltage+' '+Tolerance+' '+Footprint; HelpURL: *; Supplier: *
  C28: Parameter 1: *
C31 = Capacitor ceramic: Ceramic capacitor; Manufacturer: Yageo; Name: CC0603KRX7R0BB223; Voltage: 100V; Tolerance: ±10%; Dielectric: X7R; BOMString: =Capacitance+' '+Voltage+' '+Tolerance+' '+Footprint; HelpURL: *; Supplier: *
C33-C36 = Capacitor ceramic: Ceramic capacitor; Manufacturer: CCTC; Voltage: 25; Name: TCC0402X7R224K250AT; Tolerance: ±10%; Dielectric: X7R; BOMString: =Capacitance+' '+Voltage+' '+Tolerance+' '+Footprint; HelpURL: *; Supplier: *
C37 C38 = Capacitor ceramic: Ceramic capacitor; Manufacturer: CCTC; Name: GRM155R72A222KA01D; Voltage: 100V; Tolerance: ±10%; Dielectric: X7R; BOMString: =Capacitance+' '+Voltage+' '+Tolerance+' '+Footprint; HelpURL: *; Supplier: *
C40-C43 = Capacitor ceramic: Ceramic capacitor; Manufacturer: Taiyo Yuden; Name: HMK107C7224KAHTE; Voltage: 100V; Tolerance: ±10%; Dielectric: X7S; BOMString: =Capacitance+' '+Voltage+' '+Tolerance+' '+Footprint; HelpURL: *; Supplier: *
C44-C47 = Capacitor ceramic: Ceramic capacitor; Manufacturer: Yageo; Name: CC0402KRX7R0BB102; Voltage: 100V; Tolerance: ±10%; Dielectric: X7R; BOMString: =Capacitance+' '+Voltage+' '+Tolerance+' '+Footprint; HelpURL: *; Supplier: *
P3 = TerminalBlock4: Manufacturer: Dinkle; Name: 15EDGRC-3.5-04P; HelpURL: https://static.chipdip.ru/lib/874/DOC000874642.pdf; Supplier: https://www.chipdip.ru/product/ech381v-05p
R15 = Resistor: Thik Film Chip Resistor; Manufacturer: Uniohm; Power: 1/10 W; Tolerance: ±1%; Name: 0603WAF220KT5E; Supplier: *; HelpURL: *; BOMString: =Resistance+' '+Tolerance+' '+Power+' '+Footprint
R16-R23 = Resistor: Thik Film Chip Resistor; Manufacturer: Yageo; Power: 1/16 W; Tolerance: ±1%; Name: AC0402FR-0710RL; Supplier: *; HelpURL: *; BOMString: =Resistance+' '+Tolerance+' '+Power+' '+Footprint
R24-R27 = Resistor: Thik Film Chip Resistor; Manufacturer: Yageo; Power: 1/16 W; Tolerance: ±1%; Name: RC0402FR-0747RL; Supplier: *; HelpURL: *; BOMString: =Resistance+' '+Tolerance+' '+Power+' '+Footprint
R28 R29 = Resistor: Thik Film Chip Resistor; Manufacturer: Panasonic; Power: 1 W; Tolerance: ±1%; Name: ERJ-8CWFR050V; Supplier: *; HelpURL: *; BOMString: =Resistance+' '+Tolerance+' '+Power+' '+Footprint
Q1 Q2 = DMHT6016LFJ: Name: *; Manufacturer: *; BOMString: *; Value I: *; Value U: *

## Nets that join several sheets
3.3V: Power_Supply (C18.1 U3.5), Logic.~(138) (21 pins), Driver (5 pins)
GND: Power_Supply (19 pins), Logic.~(138) (28 pins), Driver (33 pins)
5V: Power_Supply (7 pins), Logic.~(138) (6 pins)
12V: Power_Supply (5 pins), Driver (C25.1 U7.4)
48V: Power_Supply (8 pins), Driver (13 pins)
DIAG0: Logic.~(138) (U1.11), Driver (U7.26)
ENC_CS: Logic.~(138) (U1.29), Driver (U6.1)
ENC_MISO: Logic.~(138) (U1.40), Driver (U6.3)
ENC_MOSI: Logic.~(138) (U1.43), Driver (U6.4)
ENC_SCK: Logic.~(138) (U1.39), Driver (U6.2)
FAN_PWM: Power_Supply (P2.1), Logic.~(138) (U1.41)
SD_MODE: Logic.~(138) (U1.14), Driver (U7.21)
SPI_MODE: Logic.~(138) (U1.13), Driver (U7.22)
TMC_CS: Logic.~(138) (U1.28), Driver (U7.13)
TMC_DIR: Logic.~(138) (U1.15), Driver (U7.18)
TMC_DRV_ENN: Logic.~(138) (U1.12), Driver (U7.28)
TMC_MISO: Logic.~(138) (U1.27), Driver (U7.16)
TMC_MOS: Logic.~(138) (U1.25), Driver (U7.15)
TMC_PWM: Logic.~(138) (U1.24), Driver (U7.17)
TMC_SCK: Logic.~(138) (U1.26), Driver (U7.14)